# EAGLE design HeadphoneOut (EAGLE 6.5.0)
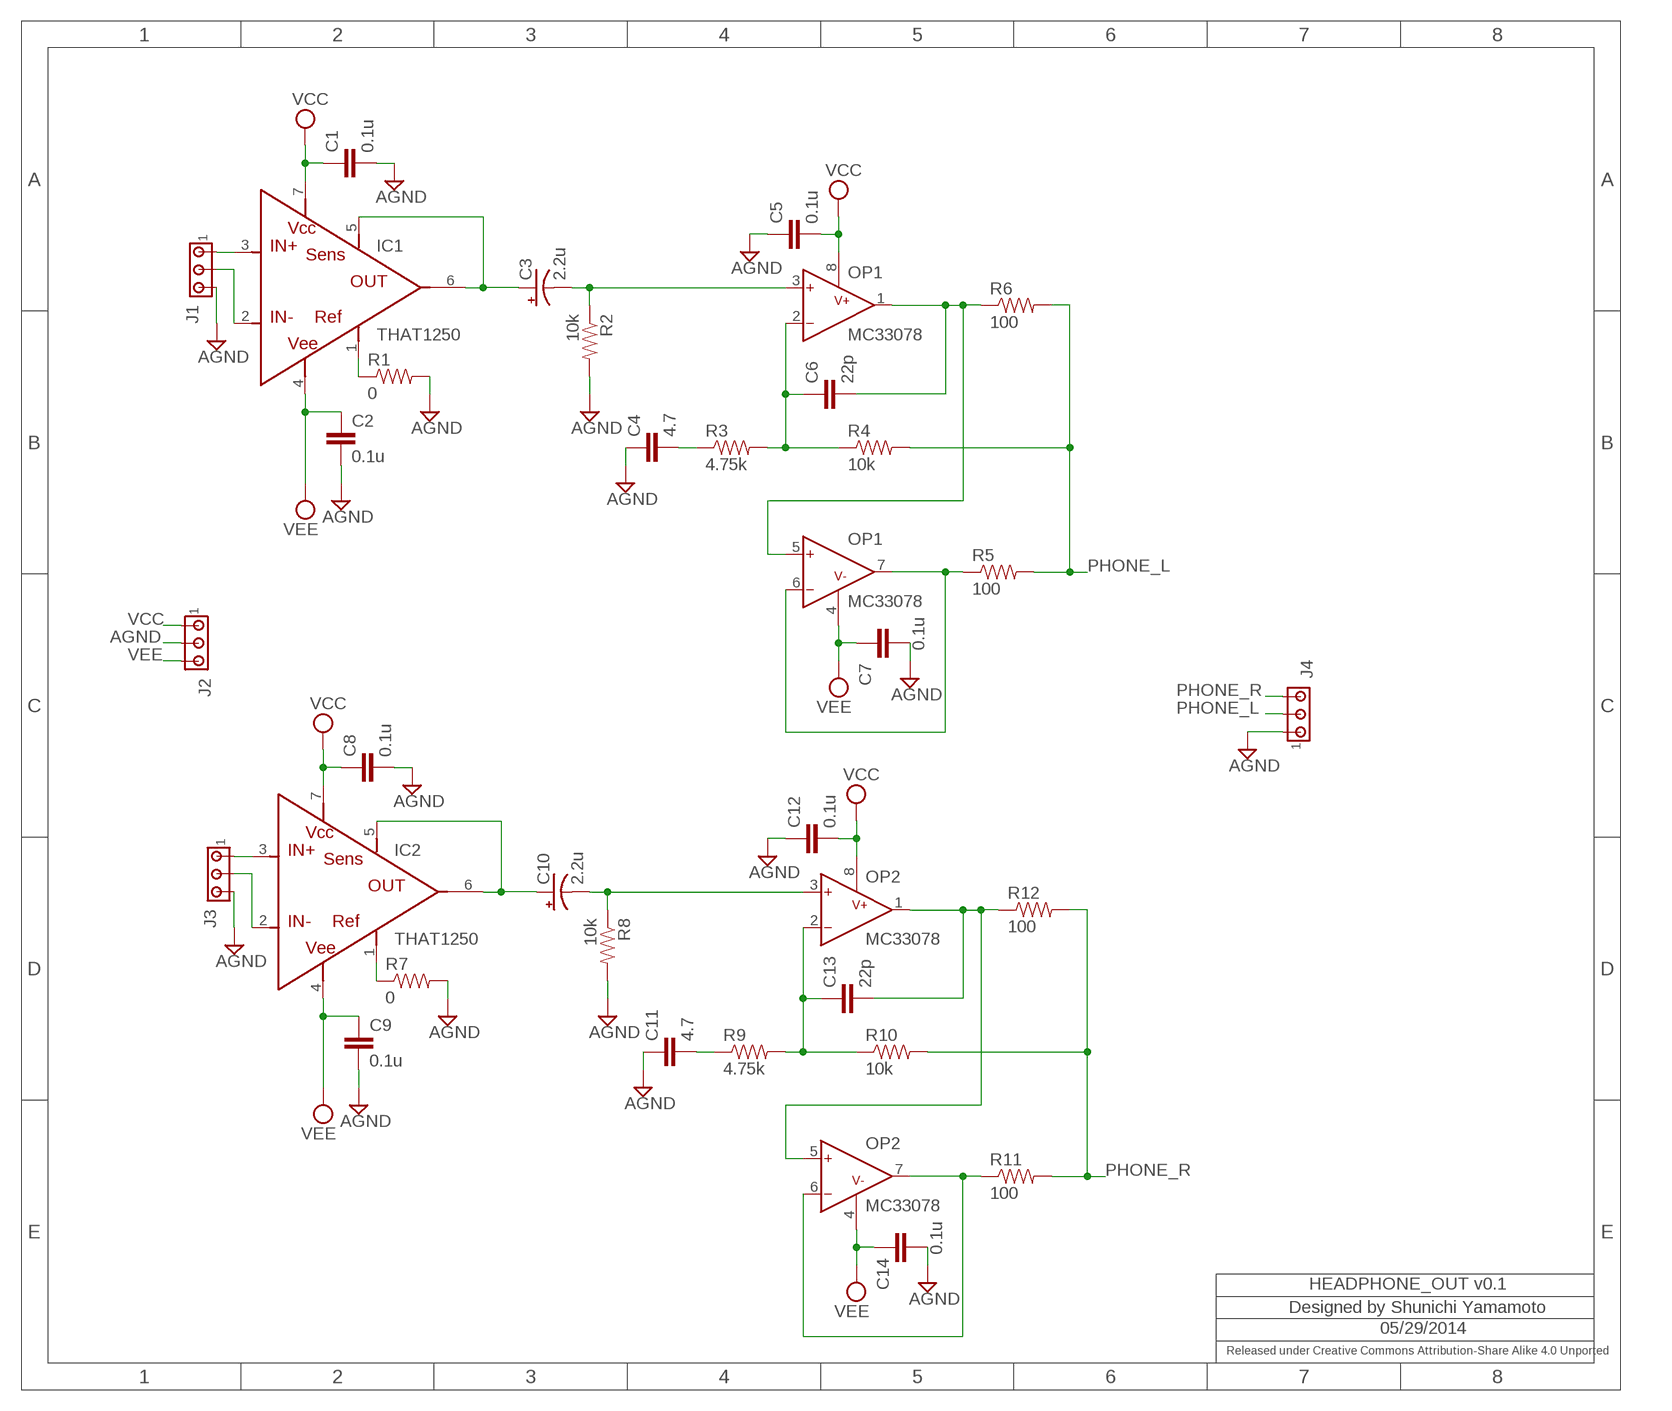
[diagram p0: schematic, sheet 1]

## Parts
C1  0.1u  C-EUC2012  [C2012]
C2  0.1u  C-EUC2012  [C2012]
C3  2.2u  CPOL-USUD-5X5,8  [UD-5X5,8_NICHICON]
C4  4.7  C-EUC2012  [C2012]
C5  0.1u  C-EUC2012  [C2012]
C6  22p  C-EUC2012  [C2012]
C7  0.1u  C-EUC2012  [C2012]
C8  0.1u  C-EUC2012  [C2012]
C9  0.1u  C-EUC2012  [C2012]
C10  2.2u  CPOL-USUD-5X5,8  [UD-5X5,8_NICHICON]
C11  4.7  C-EUC2012  [C2012]
C12  0.1u  C-EUC2012  [C2012]
C13  22p  C-EUC2012  [C2012]
C14  0.1u  C-EUC2012  [C2012]
IC1  THAT1250  [SOIC8]
IC2  THAT1250  [SOIC8]
J1  MTA03-100  [10X03MTA]
J2  MTA03-156  [1X3MTA]
J3  MTA03-100  [10X03MTA]
J4  MTA03-100  [10X03MTA]
OP1  MC33078  LME49860  [SOIC8@1]
OP2  MC33078  LME49860  [SOIC8@1]
R1  0  RESISTOR0805-RES  [0805]
R2  10k  RESISTOR0805-RES  [0805]
R3  4.75k  RESISTOR0805-RES  [0805]
R4  10k  RESISTOR0805-RES  [0805]
R5  100  RESISTOR0805-RES  [0805]
R6  100  RESISTOR0805-RES  [0805]
R7  0  RESISTOR0805-RES  [0805]
R8  10k  RESISTOR0805-RES  [0805]
R9  4.75k  RESISTOR0805-RES  [0805]
R10  10k  RESISTOR0805-RES  [0805]
R11  100  RESISTOR0805-RES  [0805]
R12  100  RESISTOR0805-RES  [0805]

## Nets
AGND: C1.2 C2.2 C4.1 C5.1 C7.2 C8.2 C9.2 C11.1 C12.1 C14.2 J1.3 J2.2 J3.3 J4.1 R1.2 R2.2 R7.2 R8.2
N$1: C6.1 OP1.2(INA-) R3.2 R4.1
N$2: C6.2 OP1.1(OUTA) OP1.5(INB+) R6.1
N$3: OP1.6(INB-) OP1.7(OUTB) R5.1
N$4: IC1.1(REF) R1.1
N$5: C3.- OP1.3(INA+) R2.1
N$6: C4.2 R3.1
N$7: C13.1 OP2.2(INA-) R9.2 R10.1
N$8: C13.2 OP2.1(OUTA) OP2.5(INB+) R12.1
N$9: OP2.6(INB-) OP2.7(OUTB) R11.1
N$10: IC1.3(IN+) J1.1
N$11: C10.- OP2.3(INA+) R8.1
N$12: C11.2 R9.1
N$13: IC1.2(IN-) J1.2
N$14: IC2.1(REF) R7.1
N$15: IC2.3(IN+) J3.1
N$16: IC2.2(IN-) J3.2
PHONE_L: J4.2 R4.2 R5.2 R6.2
PHONE_R: J4.3 R10.2 R11.2 R12.2
PIN_L: C3.+ IC1.5(SENS) IC1.6(OUT)
PIN_R: C10.+ IC2.5(SENS) IC2.6(OUT)
VCC: C1.1 C5.2 C8.1 C12.2 IC1.7(VCC) IC2.7(VCC) J2.1 OP1.8(V+) OP2.8(V+)
VEE: C2.1 C7.1 C9.1 C14.1 IC1.4(VEE) IC2.4(VEE) J2.3 OP1.4(V-) OP2.4(V-)

## Notes on the sheet
- HEADPHONE_OUT v0.1
- Designed by Shunichi Yamamoto
- 05/29/2014
- Released under Creative Commons Attribution-Share Alike 4.0 Unported

## Library data of the parts
C1 C2 C4-C9 C11-C14 = rcl:C-EU: CAPACITOR, European symbol
C3 C10 = rcl:CPOL-US: POLARIZED CAPACITOR, American symbol
IC1 IC2 = thatcorp:THAT1250
J1 J3 J4 = con-amp:MTA03-100: AMP connector
J2 = con-amp:MTA03-156: AMP connector
OP1 OP2 = thatcorp:LME49860
R1-R12 = SparkFun:RESISTOR: Resistor Basic schematic elements and footprints for 0603, 1206, and PTH resistors.

## Board
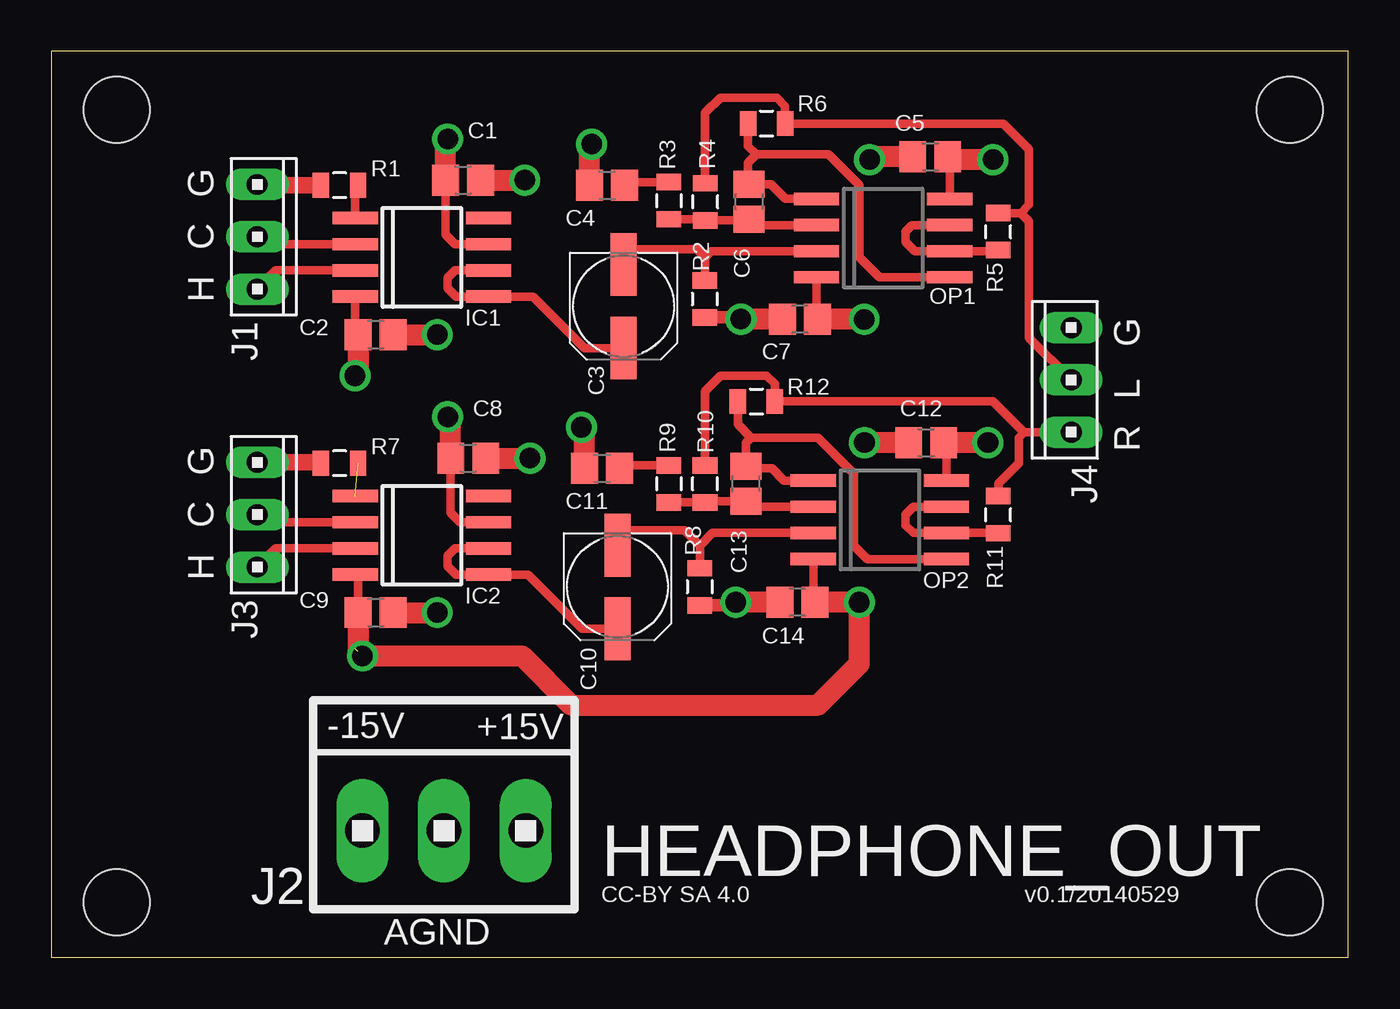
[diagram p1: board, top side]
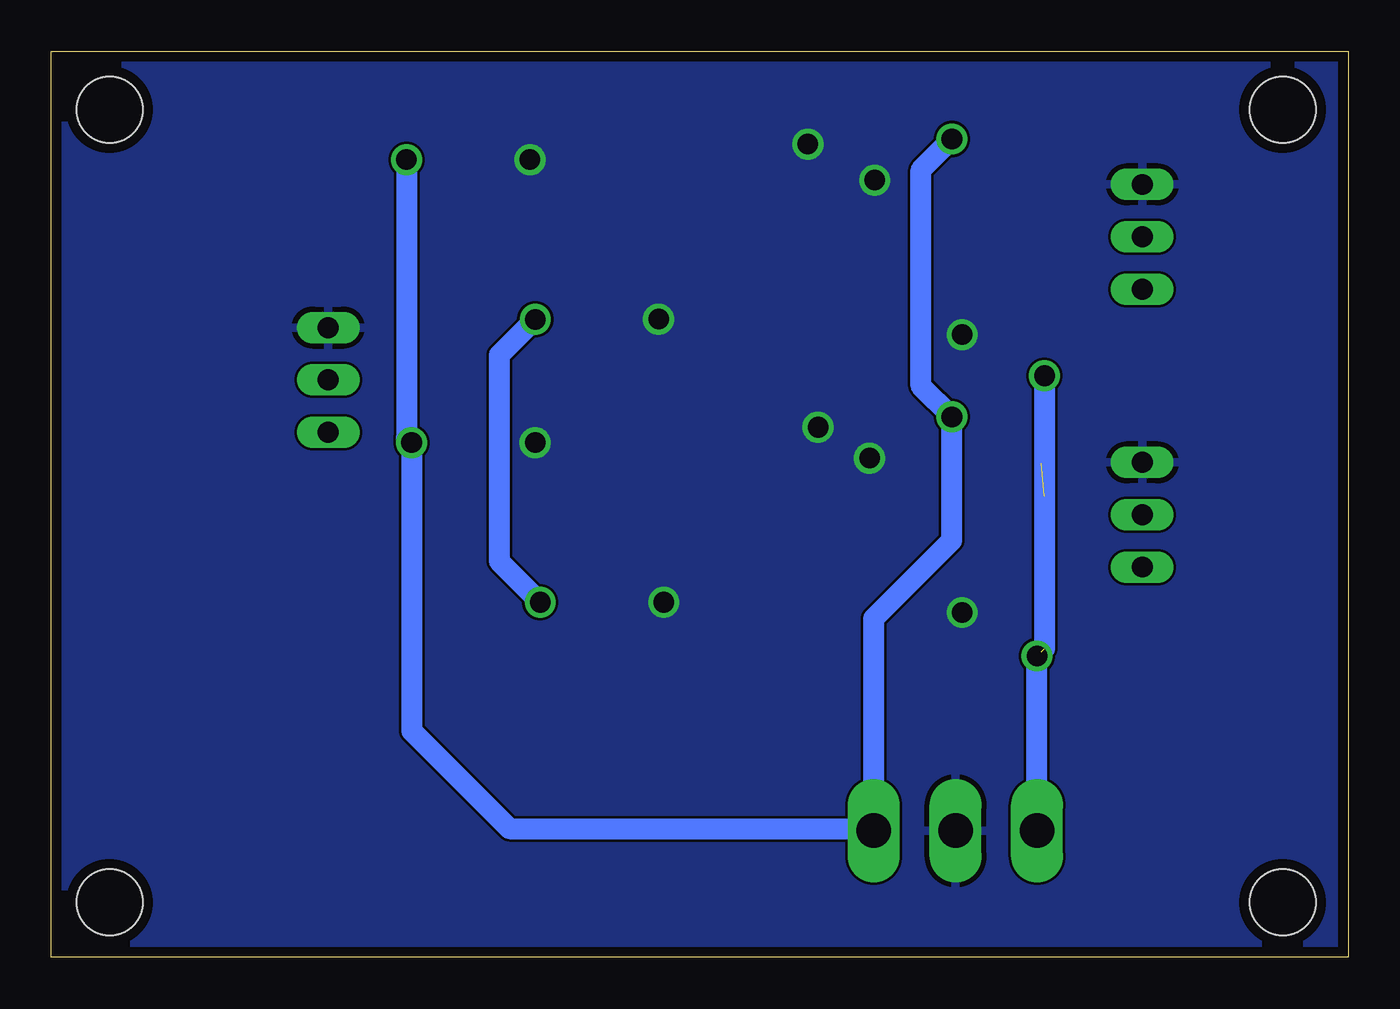
[diagram p2: board, bottom side, seen from below]

Size 63 x 44 mm. Coordinates in mm from the lower left corner, seen from the top.
Outline: 0,0 63,0 63,44 0,44 0,0
Copper layers (1*16): Top 0.035mm / dielectric 1.53mm / Bottom 0.035mm
Design rules "pban_5mil-l2": minimum track width 5mil, minimum drill 0.3mm, track to track 5mil, track to pad 0.229mm, pad to pad 5mil, via to via 5mil, smd to smd 5mil, copper to edge 0.5mm, drill to drill 0.5mm, minimum pad ring 0.15mm, minimum via ring 0.15mm, stop-mask expansion 4mil, vias tented up to drill 0.35mm, thermal gap 10mil
Holes 3.2 mm at 60.17,41.17 3.17,41.17 3.17,2.67 60.17,2.67

### Footprints (pad centres in the part's own frame; a part is rotated, then mirrored left to right if it is on the bottom)
C2012 = smd 1.3 x 1.5: 1 -0.85,0; 2 0.85,0
UD-5X5,8_NICHICON = smd 3.048 x 1.27: + 2.042,0; - -2.018,0
SOIC8 = smd 0.6 x 2.2: 1 -1.905,-3.235; 2 -0.635,-3.235; 3 0.635,-3.235; 4 1.905,-3.235; 5 1.905,3.235; 6 0.635,3.235; 7 -0.635,3.235; 8 -1.905,3.235
10X03MTA = drill 1.016 long: 1 2.54,0; 2 0,0; 3 -2.54,0
1X3MTA = drill 1.676 long: 1 3.937,0; 2 -0.025,0; 3 -3.988,0
SOIC8@1 = smd 0.6 x 2.2: 1 -1.905,-3.235; 2 -0.635,-3.235; 3 0.635,-3.235; 4 1.905,-3.235; 5 1.905,3.235; 6 0.635,3.235; 7 -0.635,3.235; 8 -1.905,3.235
0805 = smd 0.8 x 1.2: 1 -0.9,0; 2 0.9,0

### Placement (x,y rotation side)
C1  20,37.75 0 top
C2  15.75,30.25 0 top
C3  27.8,31.64 270 top
C4  27,37.5 0 top
C5  42.7,38.88 0 top
C6  33.9,36.7 90 top
C7  36.37,30.99 180 top
C8  20.25,24.25 0 top
C9  15.75,16.75 0 top
C10  27.5,18 270 top
C11  26.75,23.75 0 top
C12  42.5,25 0 top
C13  33.75,23 90 top
C14  36.25,17.25 180 top
IC1  18,34 270 top
IC2  18,20.5 270 top
J1  10,35 270 top
J2  19.1,6.15 0 top
J3  10,21.5 270 top
J4  49.55,28.05 90 top
OP1  40.41,34.94 270 top
OP2  40.25,21.25 270 top
R1  14,37.5 180 top
R2  31.75,31.98 270 top
R3  30,36.75 270 top
R4  31.77,36.7 90 top
R5  46,35.25 90 top
R6  34.75,40.5 0 top
R7  14,24 180 top
R8  31.5,18 270 top
R9  30,23 270 top
R10  31.75,23 90 top
R11  46,21.5 90 top
R12  34.25,27 0 top

### Tracks (layer width: path | path; a pad name or v marks a point on that pad's centre or on a via)
AGND  (via drill 1)
  Top 0.61: R2.2 33.42,31.08 v33.5,31 | R8.2 33.1,17.1 v33.25,17.25
  Top 0.813: R1.2 10.04,37.5 J1.3 | J3.3 13.06,24.04 R7.2 | v33.49,31 v33.5,31
  Top 1.016: C2.2 v18.75,30.25 | C1.2 v23,37.75 | C8.2 v23.25,24.25 | C9.2 v18.75,16.75 | C7.2 v33.51,30.99 v33.5,31 | C4.1 26.15,39.4 v26.25,39.5 | C5.1 39.88,38.88 v39.75,38.75 | C14.2 v33.25,17.25 | C11.1 25.9,25.6 v25.75,25.75 | C12.1 v39.5,25
  pour Bottom: -0.32,43.81 -0.32,-0.32 63.04,-0.32 63.04,43.81
N$1
  Top 0.406: OP1.2 34.43,35.57 C6.1 33.85,35.8 R4.1 31.71,35.85 R3.2
N$2
  Top 0.406: OP1.1 35.66,36.84 34.95,37.55 C6.2 33.85,37.6 33.85,38.6 34.25,39 | 34.25,39 37.75,39 39.25,37.5 39.25,34 40.22,33.03 OP1.5 | 34.25,39 33.85,39.4 R6.1
N$3
  Top 0.406: OP1.7 41.82,35.57 41.5,35.25 41.5,34.75 41.95,34.3 OP1.6 45.95,34.3 R5.1
N$4
  Top 0.406: IC1.1 14.77,37.37 R1.1
N$5
  Top 0.406: OP1.3 32.05,34.3 31.75,34 | 31.75,34 R2.1 | 31.75,34 31.36,34.38 28.14,34.38 27.8,34.05 C3.-
N$6
  Top 0.406: R3.1 28,37.65 C4.2
N$7
  Top 0.406: OP2.2 34.02,21.89 C13.1 31.8,22.15 R10.1 R9.2
N$8
  Top 0.406: OP2.1 35.59,23.16 35,23.75 33.85,23.75 C13.2 33.75,25 34,25.25 | OP2.5 39.66,19.34 39,20 39,23.5 37.25,25.25 34,25.25 | R12.1 33.35,25.9 34,25.25
N$9
  Top 0.406: R11.1 45.98,20.61 OP2.6 41.88,20.61 41.5,21 41.5,21.5 41.88,21.89 OP2.7
N$10
  Top 0.406: IC1.3 10.9,33.37 J1.1
N$11
  Top 0.406: R8.1 31.5,20 | 31.5,20 30.75,20.75 27.75,20.75 27.5,20.5 C10.- | OP2.3 32.12,20.61 31.5,20
N$12
  Top 0.406: R9.1 27.75,23.9 C11.2
N$13
  Top 0.406: IC1.2 10.37,34.63 J1.2
N$14  (1 unrouted)
N$15
  Top 0.406: IC2.3 10.9,19.86 J3.1
N$16
  Top 0.406: IC2.2 10.37,21.14 J3.2
PHONE_L
  Top 0.406: R4.2 31.77,41.02 32.5,41.75 35.25,41.75 35.65,41.35 R6.2 46.25,40.5 47.5,39.25 47.5,36.55 47.1,36.15 | R5.2 47.1,36.15 | 47.1,36.15 47.5,35.75 47.5,30.1 J4.2
PHONE_R
  Top 0.406: R10.2 31.75,27.5 32.5,28.25 34.75,28.25 35.15,27.85 R12.2 45.75,27 47.25,25.5 | 47.25,25.5 J4.3 | R11.2 46,23 47,24 47,25.25 47.25,25.5
PIN_L
  Top 0.406: IC1.6 19.61,33.37 19.25,33 19.25,32.5 19.66,32.09 IC1.5 23.41,32.09 25.91,29.59 C3.+
PIN_R
  Top 0.406: IC2.6 19.61,19.86 19.25,19.5 19.25,19 19.66,18.59 IC2.5 23.16,18.59 25.79,15.96 C10.+
VCC  (via drill 1)
  Top 0.406: IC1.7 19.61,34.63 19.15,35.1 C1.1 | IC2.7 19.86,21.14 19.4,21.6 C8.1 | OP1.8 43.65,38.78 C5.2 | OP2.8 43.48,24.86 C12.2
  Top 1.016: 19.25,26 v19.25,26.25 19.4,26.1 C8.1 | C1.1 19.15,39.65 v19.25,39.75 | v45.75,38.75 43.68,38.75 C5.2 | v45.5,25 C12.2
  Bottom 1.016: v19.25,39.75 20.75,38.25 20.75,27.75 v19.25,26.25 19.25,20.25 23.04,16.46 J2.1 23.14,6.25 40.75,6.25 45.5,11 v45.5,25 45.75,25.25 v45.75,38.75
VEE  (via drill 1)  (1 unrouted)
  Top 0.406: IC1.4 14.77,30.39 C2.1 | C9.1 14.9,18.46 IC2.4 | OP1.4 37.17,31.04 C7.1 | OP2.4 37.02,17.34 C14.1
  Top 1.016: C2.1 14.9,28.4 v14.75,28.25 | v39.49,30.99 C7.1 | C14.1 v39.25,17.25 39.25,14.25 37.25,12.25 25.25,12.25 22.86,14.64 v15.11,14.64 14.9,14.85 C9.1
  Bottom 1.016: J2.3 v15.11,14.64 15,14.75 | v14.75,28.25 14.75,15 | v39.49,30.99 39.51,30.99 41.25,29.25 41.25,19.25 v39.25,17.25

### Text on the board
tNames: G | C | H | G | L | R | G | C | H | -15V | +15V | HEADPHONE_OUT | CC-BY SA 4.0 | v0.1/20140529 | AGND